# Altium project NRF24L01 Custom Board.PrjPcb
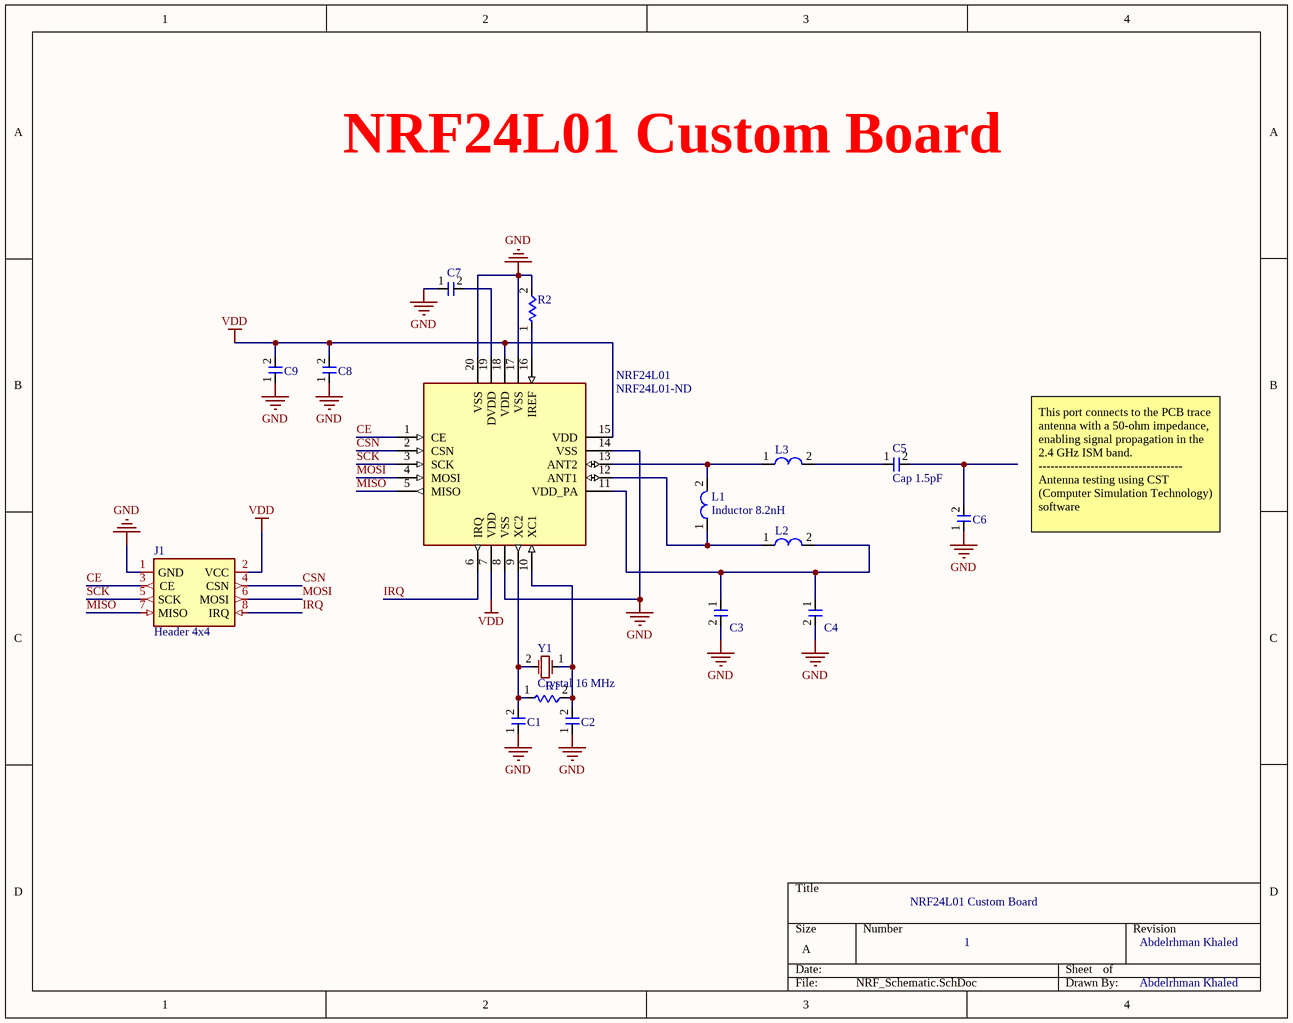
[diagram p0: NRF_Schematic.SchDoc]
1 sheet, 17 parts. Net scope: global (net labels, ports and power ports of the same name join across sheets).
Board file: NRF_PCB.PcbDoc

## Sheet NRF_Schematic.SchDoc
size A; SheetNumber: 1; SheetTotal: 1

### Parts
C1  Cap 22pF  [Cap 22pF]  (value not drawn)
C2  Cap 22pF  [Cap 22pF]  (value not drawn)
C3  Cap 2.2nF  [Cap 2.2nF]  (value not drawn)
C4  Cap 4.7pF  [Cap 4.7 pF]  (value not drawn)
C5  Cap 1.5pF  [Cap 1.5pF]
C6  Cap 1 pF  [Cap 1pF]  (value not drawn)
C7  Cap 33nf  [Cap 33nF]  (value not drawn)
C8  Cap 10nF  [Cap 10nF]  (value not drawn)
C9  Cap 10nF  [Cap 10nF]  (value not drawn)
J1  Header 4x4  [Header 4x4]
L1  Inductor 8.2nH  [Inductor 8.2nH]
L2  Inductor 2.7nH  [Inductor 2.7nH]  (value not drawn)
L3  Inductor 3.9 nH  [Inductor 3.9nH]  (value not drawn)
NRF24L01  NRF24L01-ND  [NRF24L01-ND]
R1  Resistance 1M Ohm  [Resistor 1 M Ohm]  (value not drawn)
R2  Resistance 22k Ohm  [Resistor 22k Ohm]  (value not drawn)
Y1  Crystal 16 MHz  [Crystal 16MHz]

### Nets
GND: C1.1(Pin_1) C2.1(Pin_1) C3.2(Pin_2) C4.2(Pin_2) C6.1(Pin_1) C7.1(Pin_1) C8.1(Pin_1) C9.1(Pin_1) J1.1(GND) NRF24L01.8(VSS) NRF24L01.14(VSS) NRF24L01.17(VSS) NRF24L01.20(VSS) R2.2(pin_2)
VDD: C8.2(Pin_2) C9.2(Pin_2) J1.2(VCC) NRF24L01.7(VDD) NRF24L01.15(VDD) NRF24L01.18(VDD)
CE: J1.3(CE) NRF24L01.1(CE)
CSN: J1.4(CSN) NRF24L01.2(CSN)
IRQ: J1.8(IRQ) NRF24L01.6(IRQ)
MISO: J1.7(MISO) NRF24L01.5(MISO)
MOSI: J1.6(MOSI) NRF24L01.4(MOSI)
SCK: J1.5(SCK) NRF24L01.3(SCK)
NetC1_2: C1.2(Pin_2) NRF24L01.9(XC2) R1.1(Pin_1) Y1.2
NetC2_2: C2.2(Pin_2) NRF24L01.10(XC1) R1.2(pin_2) Y1.1
NetC3_1: C3.1(Pin_1) C4.1(Pin_1) L2.2 NRF24L01.11(VDD_PA)
NetC5_1: C5.1(Pin_1) L3.2
NetC5_2: C5.2(Pin_2) C6.2(Pin_2)
NetC7_2: C7.2(Pin_2) NRF24L01.19(DVDD)
NetL1_1: L1.1 L2.1 NRF24L01.12(ANT1)
NetL1_2: L1.2 L3.1 NRF24L01.13(ANT2)
NetNRF24L01_16: NRF24L01.16(IREF) R2.1(Pin_1)

### Notes on the sheet
- NRF24L01 Custom Board
- This port connects to the PCB trace antenna with a 50-ohm impedance, enabling signal propagation in the 2.4 GHz ISM band. ------------------------------------ Antenna testing using CST (Computer Simulation Technology) software
- 1
- Abdelrhman Khaled

### Library data of the parts
L1 = Inductor 8.2nH: FIXED IND 8.2NH 680MA 100MOHM SM; Part Number: AISC-0402-8N2G-T; Link: https://www.digikey.com/en/products/detail/abracon-llc/AISC-0402-8N2G-T/3059627
NRF24L01 = NRF24L01-ND: IC RF TxRx Only General ISM > 1GHz 2.4GHz 20-VFQFN Exposed Pad; Link: https://www.digikey.com/en/products/detail/nordic-semiconductor-asa/NRF24L01/4691779
Y1 = Crystal 16 MHz: CRYSTAL 4.0000MHZ 12PF SMD; Part Number: J49SMH-A-G-G-K-4M0; Link: https://www.digikey.com/en/products/detail/jauch-quartz/J49SMH-A-G-G-K-4M0/10416031